# EAGLE design AK9750 Human Movement Sensor Breakout (EAGLE 7.7.0)
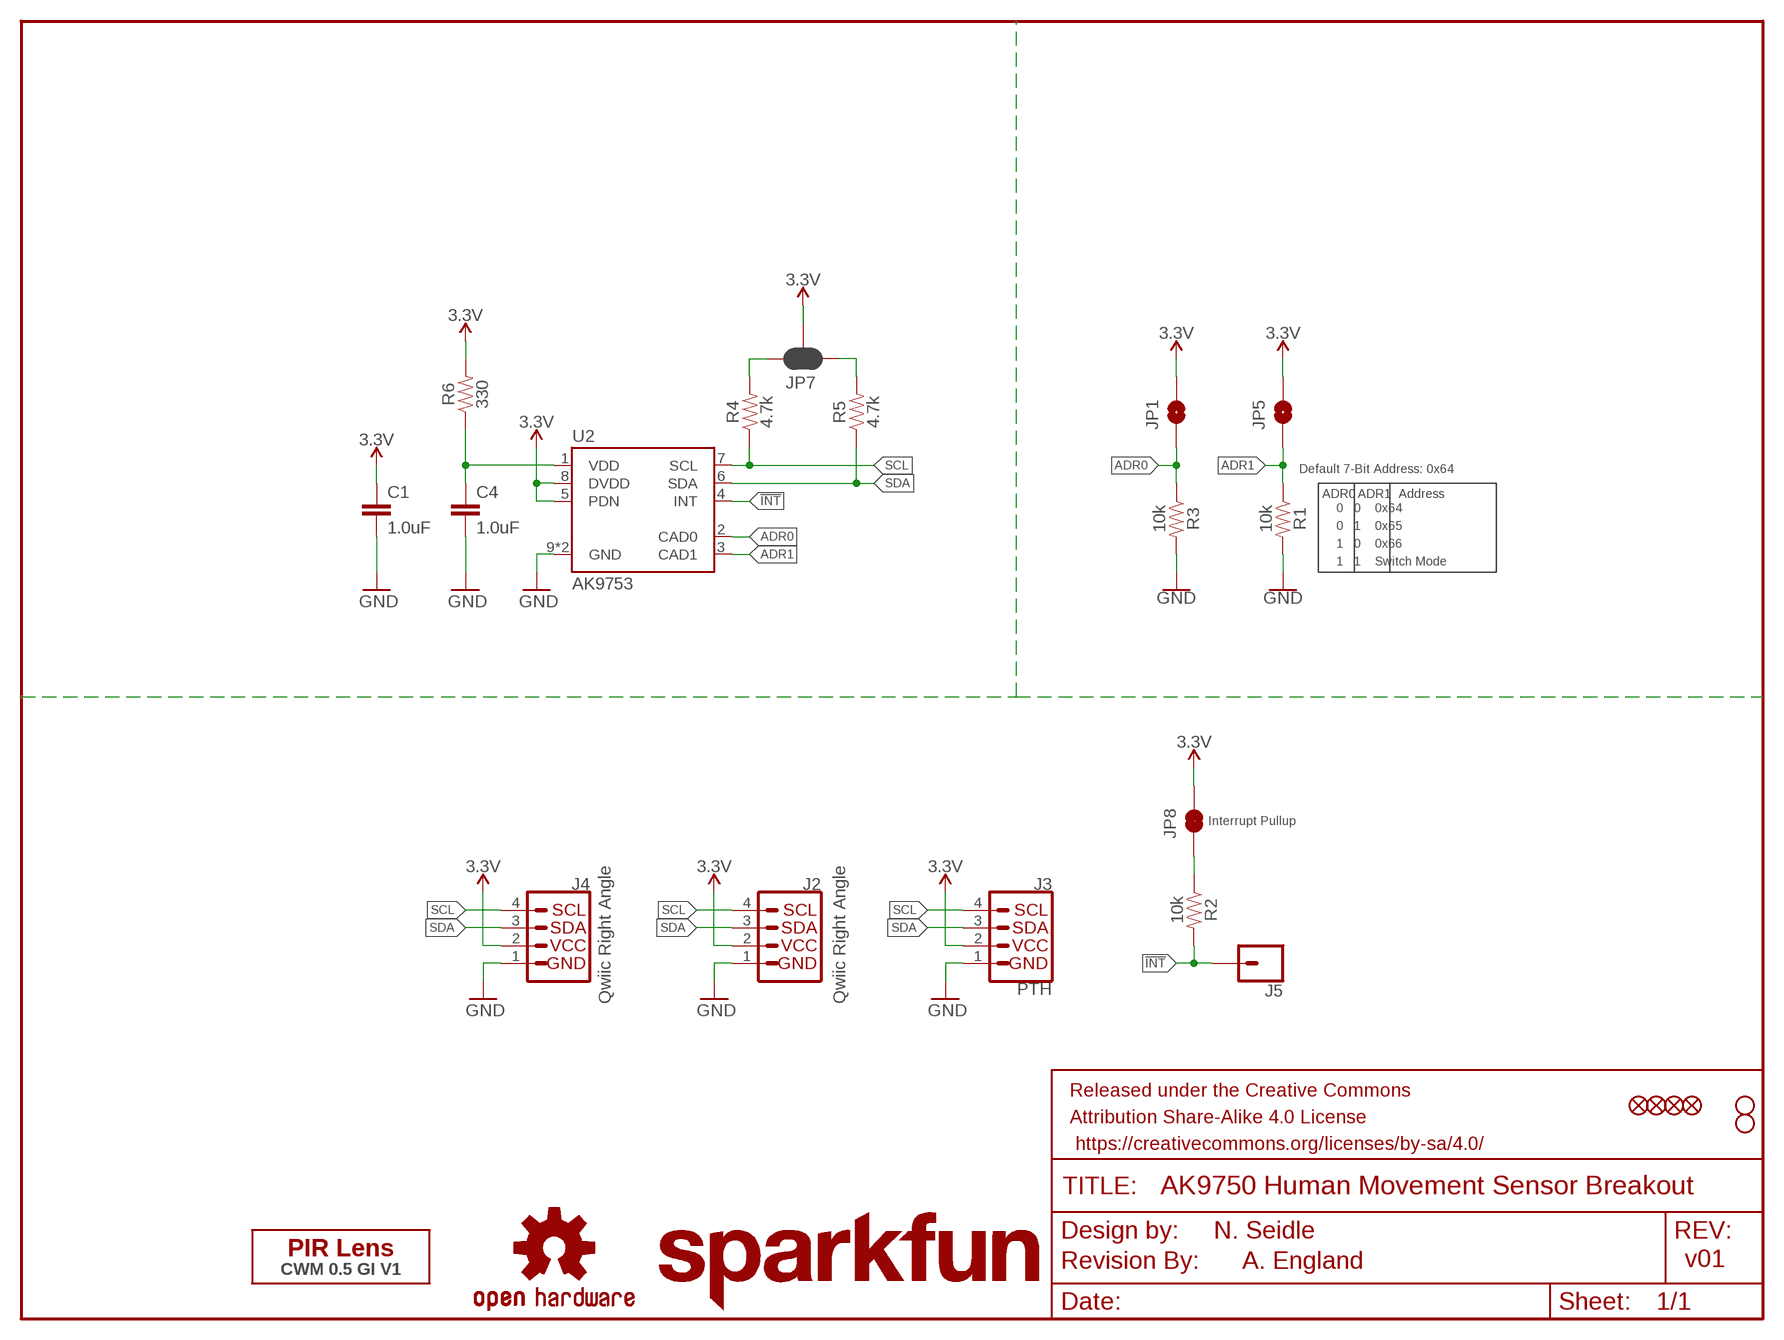
[diagram p0: schematic, sheet 1]

## Parts
C1  1.0uF  1.0UF-0603-16V-10%  [0603]
C4  1.0uF  1.0UF-0603-16V-10%  [0603]
FRAME1  FRAME-LETTER  [CREATIVE_COMMONS]
J2  Qwiic Right Angle  I2C_STANDARDQWIIC  [1X04_1MM_RA]
J3  PTH  I2C_STANDARD_NO_SILK  [1X04_NO_SILK]
J4  Qwiic Right Angle  I2C_STANDARDQWIIC  [1X04_1MM_RA]
J5  CONN_01PTH_NO_SILK_YES_STOP  [1X01_NO_SILK]
JP1  JUMPER-SMT_2_NO_SILK  [SMT-JUMPER_2_NO_SILK]
JP2  FIDUCIALUFIDUCIAL  [MICRO-FIDUCIAL]
JP3  STAND-OFF  [STAND-OFF]
JP4  STAND-OFF  [STAND-OFF]
JP5  JUMPER-SMT_2_NO_SILK  [SMT-JUMPER_2_NO_SILK]
JP6  FIDUCIALUFIDUCIAL  [MICRO-FIDUCIAL]
JP7  JUMPER-SMT_3_2-NC_PASTE_SILK  [SMT-JUMPER_3_2-NC_PASTE_SILK]
JP8  JUMPER-SMT_2_NC_TRACE_SILK  [SMT-JUMPER_2_NC_TRACE_SILK]
JP9  FIDUCIALUFIDUCIAL  [MICRO-FIDUCIAL]
JP10  FIDUCIALUFIDUCIAL  [MICRO-FIDUCIAL]
LOGO1  OSHW-LOGOMINI  [OSHW-LOGO-MINI]
LOGO2  SFE_LOGO_NAME.1_INCH  [SFE_LOGO_NAME_.1]
LOGO3  REVISION  [REVISION]
R1  10k  10KOHM-0603-1/10W-1%  [0603]
R2  10k  10KOHM-0603-1/10W-1%  [0603]
R3  10k  10KOHM-0603-1/10W-1%  [0603]
R4  4.7k  4.7KOHM-0603-1/10W-1%  [0603]
R5  4.7k  4.7KOHM-0603-1/10W-1%  [0603]
R6  330  330OHM-0603-1/10W-1%  [0603]
U2  AK9753  AK9750"  [SON10]
U$3  CWM 0.5 GI V1  PIR-LENSCWM-0.5-GI-V1  [LENS-CWM-0.5-GI-V1]

## Nets
3.3V: C1.1 J2.2 J3.2 J4.2 JP1.2 JP5.2 JP7.2 JP8.2 R6.2 U2.5(PDN) U2.8(DVDD)
!INT: J5.1 R2.2 U2.4(INT)
ADR0: JP1.1 R3.1 U2.2(CAD0)
ADR1: JP5.1 R1.1 U2.3(CAD1)
GND: C1.2 C4.2 J2.1 J3.1 J4.1 R1.2 R3.2 U2.9(GND) U2.10(GND)
N$1: JP7.1 R5.2
N$2: JP7.3 R4.2
N$3: JP8.1 R2.1
SCL: J2.4 J3.4 J4.4 R4.1 U2.7(SCL)
SDA: J2.3 J3.3 J4.3 R5.1 U2.6(SDA)
VDD: C4.1 R6.1 U2.1(VDD)

## Notes on the sheet
- Default 7-Bit Address: 0x64
- ADR0 | ADR1 | Address
- 0   0    0x64
- 0   1    0x65
- 1   0    0x66
- 1   1    Switch Mode
- Interrupt Pullup
- N. Seidle
- A. England | v01

## Library data of the parts
C1 C4 = SparkFun-Capacitors:1.0UF: 1µF ceramic capacitors A capacitor is a passive two-terminal electrical component used to store electrical energy temporarily in an electric field.; PROD_ID: CAP-00868
FRAME1 = SparkFun-Aesthetics:FRAME-LETTER: Schematic Frame - Letter Standard 8.5x11 US Letter frame
J2 J4 = SparkFun-Connectors:I2C_STANDARD: SparkFun I2C Standard Pinout Header SparkFun has standardized on a pinout for all I2C based sensor breakouts. This pinout allows I2C boards to be plugged directly into the headers on Arduino Uno compatible boards, and to be daisy chained easily. Example SparkFun Products: SparkFun Atmospheric Sensor Breakout - BME280 <https://www.sparkfun.com/products/13676> SparkFun Altitude/Pressure Sensor Breakout - MPL3115A2 <https://www.sparkfun.com/products/11084> SparkFun TOF Range Finder Sensor - VL6180 <https://www.sparkfun.com/products/12785>; PROD_ID: CONN-13729
J3 = SparkFun-Connectors:I2C_STANDARD: SparkFun I2C Standard Pinout Header SparkFun has standardized on a pinout for all I2C based sensor breakouts. This pinout allows I2C boards to be plugged directly into the headers on Arduino Uno compatible boards, and to be daisy chained easily. Example SparkFun Products: SparkFun Atmospheric Sensor Breakout - BME280 <https://www.sparkfun.com/products/13676> SparkFun Altitude/Pressure Sensor Breakout - MPL3115A2 <https://www.sparkfun.com/products/11084> SparkFun TOF Range Finder Sensor - VL6180 <https://www.sparkfun.com/products/12785>
J5 = SparkFun-Connectors:CONN_01: Single connection point. Often used as Generic Header-pin footprint for 0.1 inch spaced/style header connections On any of the 0.1 inch spaced packages, you can populate with these: Break Away Headers - Straight <https://www.sparkfun.com/products/116> (PRT-00116) Break Away Male Headers - Right Angle <https://www.sparkfun.com/products/553> (PRT-00553) Female Headers <https://www.sparkfun.com/products/115> (PRT-00115) Break Away Headers - Machine Pin <https://www.sparkfun.com/products/117> (PRT-00117) Break Away Female Headers - Swiss Machine Pin <https://www.sparkfun.com/products/743> (PRT-00743) This device is also useful as a general connection point to wire up your design to another part of your project. Our various solder wires solder well into these plated through hole pads. Hook-Up Wire - Assortment (Stranded, 22 AWG) <https://www.sparkfun.com/products/11375> (PRT-11375) Hook-Up Wire - Assortment (Solid Core, 22 AWG) <https://www.sparkfun.com/products/11367> (PRT-11367) View the entire wire category on our website here <https://www.sparkfun.com/categories/141> Special notes: SMTSO-256-ET is a "flush mount" nut for a 4-40 screw. We mostly use this on specialty testbeds; it is a nice way to connect hardware to your PCB at an adjustable hieght. Also note, the SNAP packages are for using a snappable style connector. We sell a baggie of snaps and they are also used on two LilyPad designs: Snap Assortment - 30 pack (male and female) <https://www.sparkfun.com/products/11347> (DEV-11347) LilyPad Arduino SimpleSnap <https://www.sparkfun.com/products/10941> (DEV-10941) LilyPad SimpleSnap Protoboard <https://www.sparkfun.com/products/10940> (DEV-10940)
JP1 JP5 = SparkFun-Jumpers:JUMPER-SMT_2_NO: Normally open jumper This jumper has two pads in close proximity to each other. Apply solder to close the connection. Round pads are easier to solder for beginners, but are a lot larger. SparkFun Product that uses the round pads: SparkFun EL Sequencer <https://www.sparkfun.com/products/12781>
JP2 JP6 JP9 JP10 = SparkFun:FIDUCIAL: Fiducial Alignment Points Various fiducial points for machine vision alignment.
JP3 JP4 = SparkFun:STAND-OFF: Stand Off This is the mechanical footprint for a #4 phillips button head screw. Use the keepout ring to avoid running the screw head into surrounding components. SKU : PRT-00447
JP7 = SparkFun-Jumpers:JUMPER-SMT_3_2-NC_PASTE: Normally closed solder jumper (2 of 2 connections) This jumper has an aperture in the stencil to allow solder paste to bridge both connections. Both connections are normally closed (NC). Wick off the solder to open the connection(s). Reapply solder to reclose the connection(s).
JP8 = SparkFun-Jumpers:JUMPER-SMT_2_NC_TRACE: Normally closed trace jumper This jumper has a trace between two pads so it's normally closed (NC). Use a razor knife to open the connection. For best results follow the IPC guidelines for cutting traces: Cutout at least 0.063 mm (0.005 in). Remove all loose material to clean up the cut area. Seal the cut with an approved epoxy. Reapply solder to reclose the connection.
LOGO1 = SparkFun-Aesthetics:OSHW-LOGO: Open-Source Hardware (OSHW) Logo This logo indicates the piece of hardware it is found on incorporates a OSHW license and/or adheres to the definition of open source hardware found here: http://freedomdefined.org/OSHW
LOGO2 = SparkFun-Aesthetics:SFE_LOGO_NAME: SparkFun Font Logo This is the SparkFun name logo. The logo on the schematic will always be the same size; the package variant is the height of the flame part of the logo (or the height the flame would be, if it were drawn). Default layer for the logo on the board is tSilk.
LOGO3 = SparkFun-Aesthetics:REVISION: "Revision By" Text Preceding text for revisor documentation. Includes schematic text on "symbols" layer, and board text on tDoc.
R1-R3 = SparkFun-Resistors:10KOHM: 10kΩ resistor A resistor is a passive two-terminal electrical component that implements electrical resistance as a circuit element. Resistors act to reduce current flow, and, at the same time, act to lower voltage levels within circuits. - Wikipedia; PROD_ID: RES-00824
R4 R5 = SparkFun-Resistors:4.7KOHM: 4.7kΩ resistor A resistor is a passive two-terminal electrical component that implements electrical resistance as a circuit element. Resistors act to reduce current flow, and, at the same time, act to lower voltage levels within circuits. - Wikipedia; PROD_ID: RES-07857
R6 = SparkFun-Resistors:330OHM: 330Ω resistor A resistor is a passive two-terminal electrical component that implements electrical resistance as a circuit element. Resistors act to reduce current flow, and, at the same time, act to lower voltage levels within circuits. - Wikipedia; PROD_ID: RES-00818
U2 = SparkFun-Sensors:AK9750: AK9750/AK9753 Human Movement Sensor; PROD_ID: SEN_13772
U$3 = openPIR-temp:PIR-LENS: PIR Fresnel Lens Fresnel lenses are used to modify the field-of-view of PIR sensors. They are available with a range of focal lengths, viewing angles, and viewing distances. Variant list Variant Name Manufacturer Mfr Part# Notes AA-0.9-GI-T1 Zilog ZAA09GIT1 35.6mm x 49.9mm Flat Lens 88° viewing angle 22.9mm focal length 25m range CWM-0.5-GI-V1 Zilog ZCWM05GIV1 PCB-mount circular lens 14.2mm focal length 180° viewing angle NCL-11 Zilog NCL-11 PCB-mount, black rectangular lens 104° viewing angle 4m range Datasheet for Zilog lensees <http://media.digikey.com/pdf/Data%20Sheets/ZiLOG%20PDFs/Zmotion%20Lens%20&%20Pyroelectric%20Sensor%20Spec.pdf>

## Board
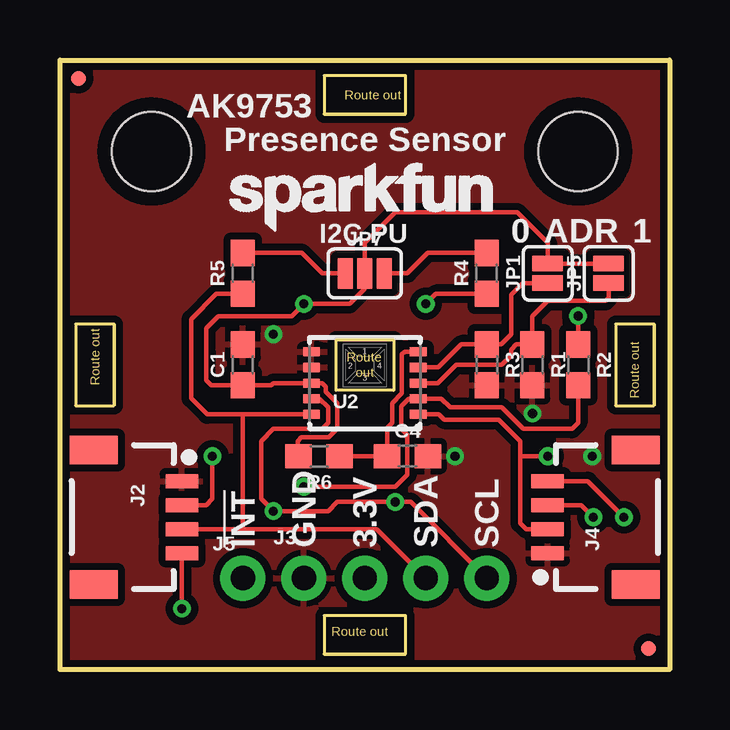
[diagram p1: board, top side]
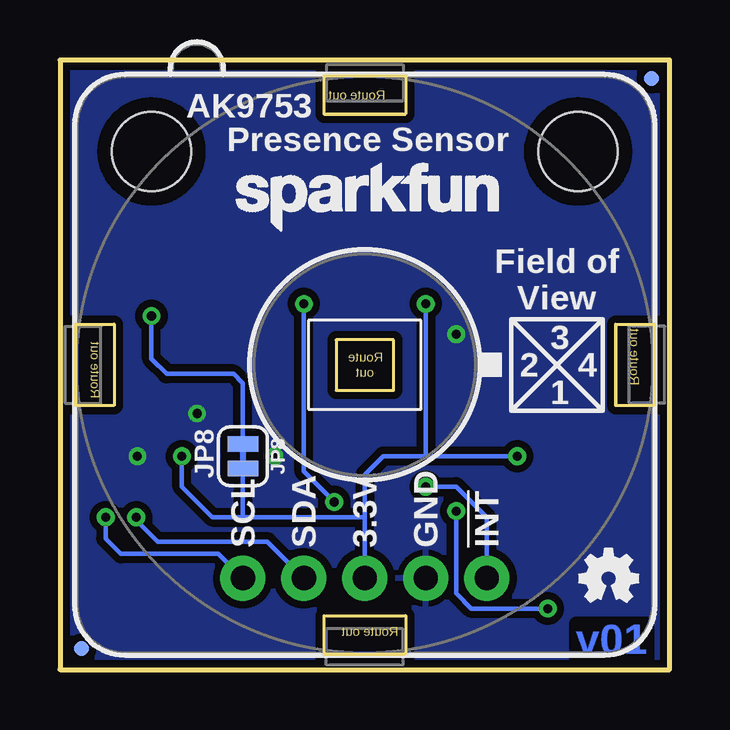
[diagram p2: board, bottom side, seen from below]

Size 25.4 x 25.4 mm. Coordinates in mm from the lower left corner, seen from the top.
Outline: 0,0 0,25.4 25.4,25.4 25.4,0 0,0
Copper layers (1*16): Top 0.035mm / dielectric 1.5mm / Bottom 0.035mm
Design rules "SparkFun-2-layer-TIGHT": minimum track width 7mil, minimum drill 15mil, track to track 7mil, track to pad 7mil, pad to pad 7mil, via to via 7mil, smd to smd 7mil, copper to edge 7mil, drill to drill 7mil, minimum pad ring 7mil, minimum via ring 7mil, stop-mask expansion 4mil, vias tented up to drill 25mil, thermal gap 10mil

### Footprints (pad centres in the part's own frame; a part is rotated, then mirrored left to right if it is on the bottom)
0603 = smd 1.1 x 1: 1 -0.85,0; 2 0.85,0
1X04_1MM_RA = smd 0.6 x 1.35: 1 -1.5,0; 2 -0.5,0; 3 0.5,0; 4 1.5,0 | smd 1.2 x 2: NC1 2.8,-3.675; NC2 -2.8,-3.675
1X04_NO_SILK = drill 1.016 pad 1.88: 1 0,0; 2 2.54,0; 3 5.08,0; 4 7.62,0
1X01_NO_SILK = drill 1.016 pad 1.88: 1 0,0
SMT-JUMPER_2_NO_SILK = smd 0.635 x 1.27: 1 -0.406,0; 2 0.406,0
MICRO-FIDUCIAL = smd 0.635 x 0.635: 1 0,0
STAND-OFF = hole 3.302: 0,0
SMT-JUMPER_3_2-NC_PASTE_SILK = smd 0.635 x 1.27: 1 -0.813,0; 2 0,0; 3 0.813,0
SMT-JUMPER_2_NC_TRACE_SILK = smd 0.635 x 1.27: 1 -0.508,0; 2 0.508,0
SON10 = smd 0.7 x 0.38: 1 2.225,1.3; 2 2.225,0.65; 3 2.225,0; 4 2.225,-0.65; 5 2.225,-1.3; 6 -2.225,-1.3; 7 -2.225,-0.65; 8 -2.225,0; 9 -2.225,0.65; 10 -2.225,1.3

### Placement (x,y rotation side)
C1  7.62,12.7 90 top
C4  14.48,8.89 0 top
FRAME1  -20.32,-17.78 0 top  (outside the outline)
J2  5.08,6.35 270 top
J3  10.16,3.81 0 top
J4  20.32,6.35 90 top
J5  7.62,3.81 0 top
JP1  20.32,16.51 90 top
JP2  24.51,0.89 0 top
JP3  3.81,21.59 0 top
JP4  21.59,21.59 0 top
JP5  22.86,16.51 90 top
JP6  0.76,24.64 0 top
JP7  12.7,16.51 0 top
JP8  17.78,8.89 270 bottom
JP9  0.76,24.64 0 bottom
JP10  24.51,0.89 0 bottom
LOGO1  2.54,3.81 0 bottom
LOGO2  6.6,17.78 0 top
LOGO3  -8.89,-20.32 0 top  (outside the outline)
R1  19.68,12.7 270 top
R2  21.59,12.7 270 top
R3  17.78,12.7 270 top
R4  17.78,16.51 90 top
R5  7.62,16.51 90 top
R6  10.79,8.89 180 top
U2  12.7,11.94 0 top
U$1  [ORDERING_INSTRUCTIONS]  -36.83,-22.86 0 top  (outside the outline)
U$2  [SFE_LOGO_NAME_.1]  18.54,17.78 0 bottom
U$3  12.7,12.7 0 bottom

### Tracks (layer width: path | path; a pad name or v marks a point on that pad's centre or on a via)
3.3V  (via drill 0.38)
  Top 0.178: 6.1,13.21 6.1,12.06 6.31,11.85 C1.1 8.8,11.85 8.89,11.94 U2.8 10.92,11.94 11.07,11.79 11.07,11.58 11.56,11.1 11.56,10.03 11.2,9.68 10.06,9.68 9.91,9.53 9.91,8.93 R6.2 | 6.1,13.21 6.1,14.22 6.6,14.73 9.65,14.73 v10.16,15.24 12.06,15.24 12.7,15.88 JP7.2 12.7,17.78 13.97,19.05 19.05,19.05 20.32,17.78 JP1.2 JP5.2 | 6.09,13.2 6.1,13.21 | J4.2 19.42,5.85 19.18,6.1 19.18,8.89 | 19.18,8.89 19.18,9.53 18.29,10.41 16,10.41 15.78,10.64 U2.5 | v6.35,8.89 6.35,7.11 6.09,6.85 J2.2 | v20.32,8.89 19.18,8.89
  Bottom 0.178: 17.78,9.4 17.78,6.35 | v6.35,8.89 10.16,8.89 | v10.16,15.24 10.16,8.89 | 17.78,6.35 19.05,6.35 20.32,7.62 v20.32,8.89 | J3.2 12.7,6.35 | 10.16,8.89 11.94,8.89 12.7,8.13 12.7,6.35 | 17.78,6.35 12.7,6.35
!INT  (via drill 0.38)
  Top 0.178: R2.2 21.59,10.29 21.34,10.03 19.3,10.03 18.41,10.92 16.26,10.92 15.89,11.29 U2.4 14.54,11.29 14.22,10.97 14.22,10.03 14.48,9.78 14.48,8.13 13.97,7.62 v10.16,7.62
  Bottom 0.178: v10.16,7.62 8.89,7.62 7.62,6.35 J5.1
ADR0
  Top 0.178: U2.2 15.76,12.59 16.73,13.55 R3.1 18.38,13.55 18.8,13.97 18.8,15.62 19.28,16.1 JP1.1
ADR1
  Top 0.178: U2.3 15.75,11.94 16.51,12.7 18.41,12.7 18.8,13.08 18.8,13.34 19.01,13.55 R1.1 19.68,14.73 20.32,15.37 22.73,15.37 22.86,15.49 JP5.1
GND  (via drill 0.38)
  other vias: 8.89,13.97 19.68,10.67 16.46,8.89 22.17,8.89
  pour Bottom (isolate 0.305): 0,0 0,25.4 25.4,25.4 25.4,0
  pour Top (isolate 0.305): 0,0 0,25.4 25.4,25.4 25.4,0
N$1
  Top 0.178: JP7.1 10.92,16.51 10.07,17.36 R5.2
N$2
  Top 0.178: JP7.3 14.48,16.51 15.33,17.36 R4.2
N$3  (via drill 0.38)
  Top 0.178: R2.1 v21.59,14.73
  Bottom 0.178: JP8.1 17.78,11.94 18.16,12.32 20.95,12.32 21.59,12.95 v21.59,14.73
SCL  (via drill 0.38)
  Top 0.178: J4.4 22,7.85 v23.5,6.35 | J2.4 v5.08,2.54 | R4.1 15.66,15.66 v15.24,15.24 | U2.7 10.81,11.29 11.18,10.92 11.18,10.29 10.92,10.03 8.89,10.03 8.38,9.53 8.38,7.11 v8.89,6.6 11.18,6.6 11.56,6.99 v13.97,6.99 14.61,6.99 J3.4
  Bottom 0.178: v23.5,6.35 23.5,5.46 22.86,4.83 18.8,4.83 J3.4 | v5.08,2.54 8.26,2.54 8.89,3.17 v8.89,6.6 | v13.97,6.99 15.24,8.26 v15.24,15.24
SDA  (via drill 0.38)
  Top 0.178: J4.3 21.73,6.85 v22.23,6.35 | R5.1 6.52,15.66 5.46,14.61 5.46,11.3 6.13,10.64 7.62,10.64 | U2.6 7.62,10.64 | 7.62,5.85 7.62,10.64 | J2.3 7.62,5.85 | 7.62,5.85 13.2,5.85 J3.3
  Bottom 0.178: v22.23,6.35 22.23,6.22 21.34,5.33 16.76,5.33 J3.3
VDD
  Top 0.178: R6.1 C4.1 13.63,10.07 13.84,10.29 13.84,11.1 14.25,11.51 14.25,13.13 14.36,13.24 U2.1

### Text on the board
Bottom: v01
Dimension: Route out | Route out | Route | out | Route out | Route out
tPlace: AK9753 | Presence Sensor | I2C PU | 0 | ADR | 1 | !INT | GND | 3.3V | SDA | SCL
bPlace: AK9753 | Presence Sensor | Field of / View | 3 | 4 | 2 | 1 | JP8 | !INT | GND | 3.3V | SDA | SCL
tDocu: N. Seidle | A. England | Rear mounted sensor / requires 0.8mm thick PCB